# EAGLE design Sens_BH1750 (EAGLE 7.7.0)
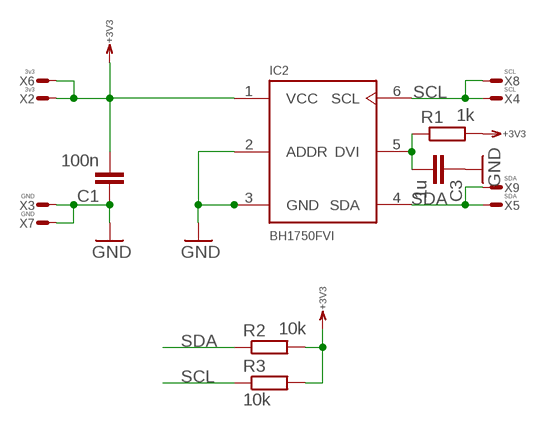
[diagram p0: schematic, sheet 1]

## Parts
C1  100n  C0603  [0603]
C3  1u  C0603  [0603]
IC2  BH1750FVI  [WSOF6I]
R1  1k  R0603  [0603]
R2  10k  R0603  [0603]
R3  10k  R0603  [0603]
X2  3v3  WIREPADT1.6/0.9  [T1.6/0.9]
X3  GND  WIREPADT1.6/0.9  [T1.6/0.9]
X4  SCL  WIREPADT1.6/0.9  [T1.6/0.9]
X5  SDA  WIREPADT1.6/0.9  [T1.6/0.9]
X6  3v3  WIREPADT1.6/0.9  [T1.6/0.9]
X7  GND  WIREPADT1.6/0.9  [T1.6/0.9]
X8  SCL  WIREPADT1.6/0.9  [T1.6/0.9]
X9  SDA  WIREPADT1.6/0.9  [T1.6/0.9]

## Nets
+3V3: C1.2 IC2.1(VCC) R1.2 R2.2 R3.2 X2.1(S) X6.1(S)
GND: C1.1 C3.1 IC2.2(ADDR) IC2.3(GND) X3.1(S) X7.1(S)
N$1: C3.2 IC2.5(DVI) R1.1
SCL: IC2.6(SCL) R3.1 X4.1(S) X8.1(S)
SDA: IC2.4(SDA) R2.1 X5.1(S) X9.1(S)

## Library data of the parts
C1 C3 = RCL:C: Capacitor SMD
IC2 = Optic:BH1750FVI
R1-R3 = RCL:R: Resistor SMD
X2-X9 = Conn:WIREPAD: Wire PAD connect wire on PCB

## Board
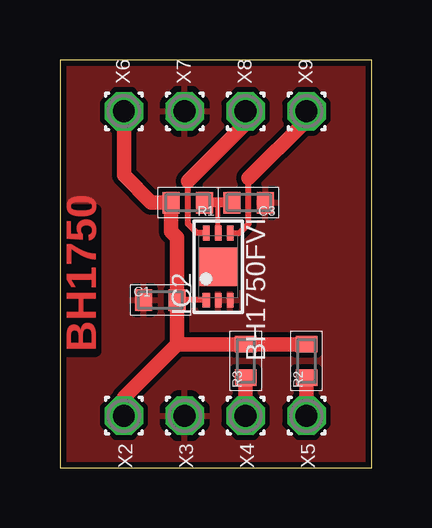
[diagram p1: board, top side]
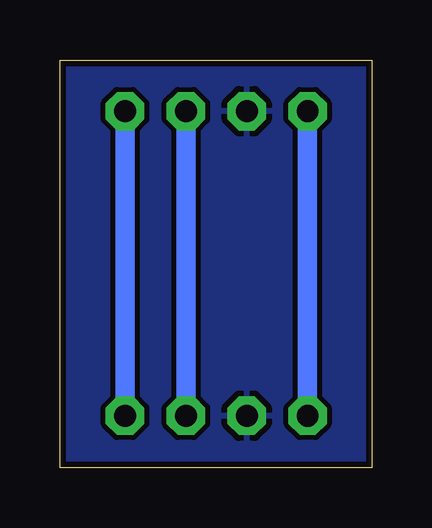
[diagram p2: board, bottom side, seen from below]

Size 13 x 17 mm. Coordinates in mm from the lower left corner, seen from the top.
Outline: 0,0 13,0 13,17 0,17 0,0
Copper layers (1*16): Top 0.035mm / dielectric 1.5mm / Bottom 0.035mm
Design rules "default *": minimum track width 10mil, minimum drill 12mil, track to track 8mil, track to pad 8mil, pad to pad 8mil, via to via 8mil, smd to smd 6mil, copper to edge 10mil, drill to drill 8mil, minimum pad ring 10mil, minimum via ring 8mil, stop-mask expansion 4mil, vias tented up to drill 0mil, thermal gap 10mil

### Footprints (pad centres in the part's own frame; a part is rotated, then mirrored left to right if it is on the bottom)
0603 = smd 0.7 x 0.9: 1 -0.697,0; 2 0.697,0
WSOF6I = smd 0.61 x 0.305: 1 -1.4,0.5 | smd 0.61 x 0.254: 2 -1.4,0; 3 -1.4,-0.5; 4 1.4,-0.5; 5 1.4,0; 6 1.4,0.5 | smd 1.6 x 1.6: P 0,0
T1.6/0.9 = drill 0.914 pad 1.6 octagon: 1 0,0

### Placement (x,y rotation side)
C1  4.19,6.99 0 top
C3  7.87,11.05 180 top
IC2  6.6,8.38 90 top
R1  5.33,11.05 180 top
R2  10.29,4.45 90 top
R3  7.75,4.45 90 top
X2  2.67,2.16 270 top
X3  5.21,2.16 270 top
X4  7.75,2.16 270 top
X5  10.29,2.16 270 top
X6  2.67,14.86 90 top
X7  5.21,14.86 90 top
X8  7.75,14.86 90 top
X9  10.29,14.86 90 top

### Tracks (layer width: path | path; a pad name or v marks a point on that pad's centre or on a via)
+3V3
  Top 0.254: IC2.1 C1.2
  Top 0.406: 4.89,5.14 4.95,5.14 4.89,5.21
  Top 0.61: X6.1 2.67,12.19 3.81,11.05 R1.2 4.64,9.84 4.89,9.59 C1.2 4.89,5.21 | R2.2 R3.2 4.95,5.14 | 4.89,5.14 2.67,2.92 X2.1
  Bottom 0.813: X2.1 X6.1
GND
  pour Top: 0,17 13,17 13,0 0,0
  pour Bottom: 0,0 13,0 13,17 0,17
N$1
  Top 0.203: IC2.5 6.6,11.05
  Top 0.406: R1.1 6.6,11.05 C3.2
SCL
  Top 0.254: IC2.6 5.71,9.78 5.33,10.16 5.33,11.94
  Top 0.61: R3.1 X4.1 | X8.1 7.75,14.35 5.33,11.94
  Bottom 0.813: X8.1 X4.1
SDA
  Top 0.254: IC2.4 7.5,9.78 7.87,10.16 7.87,12.06
  Top 0.61: R2.1 X5.1 | X9.1 10.29,14.48 7.87,12.06
  Bottom 0.813: X9.1 X5.1

### Text on the board
Top: BH1750